# EAGLE schematic al_1S_charger (EAGLE 9.6.2)
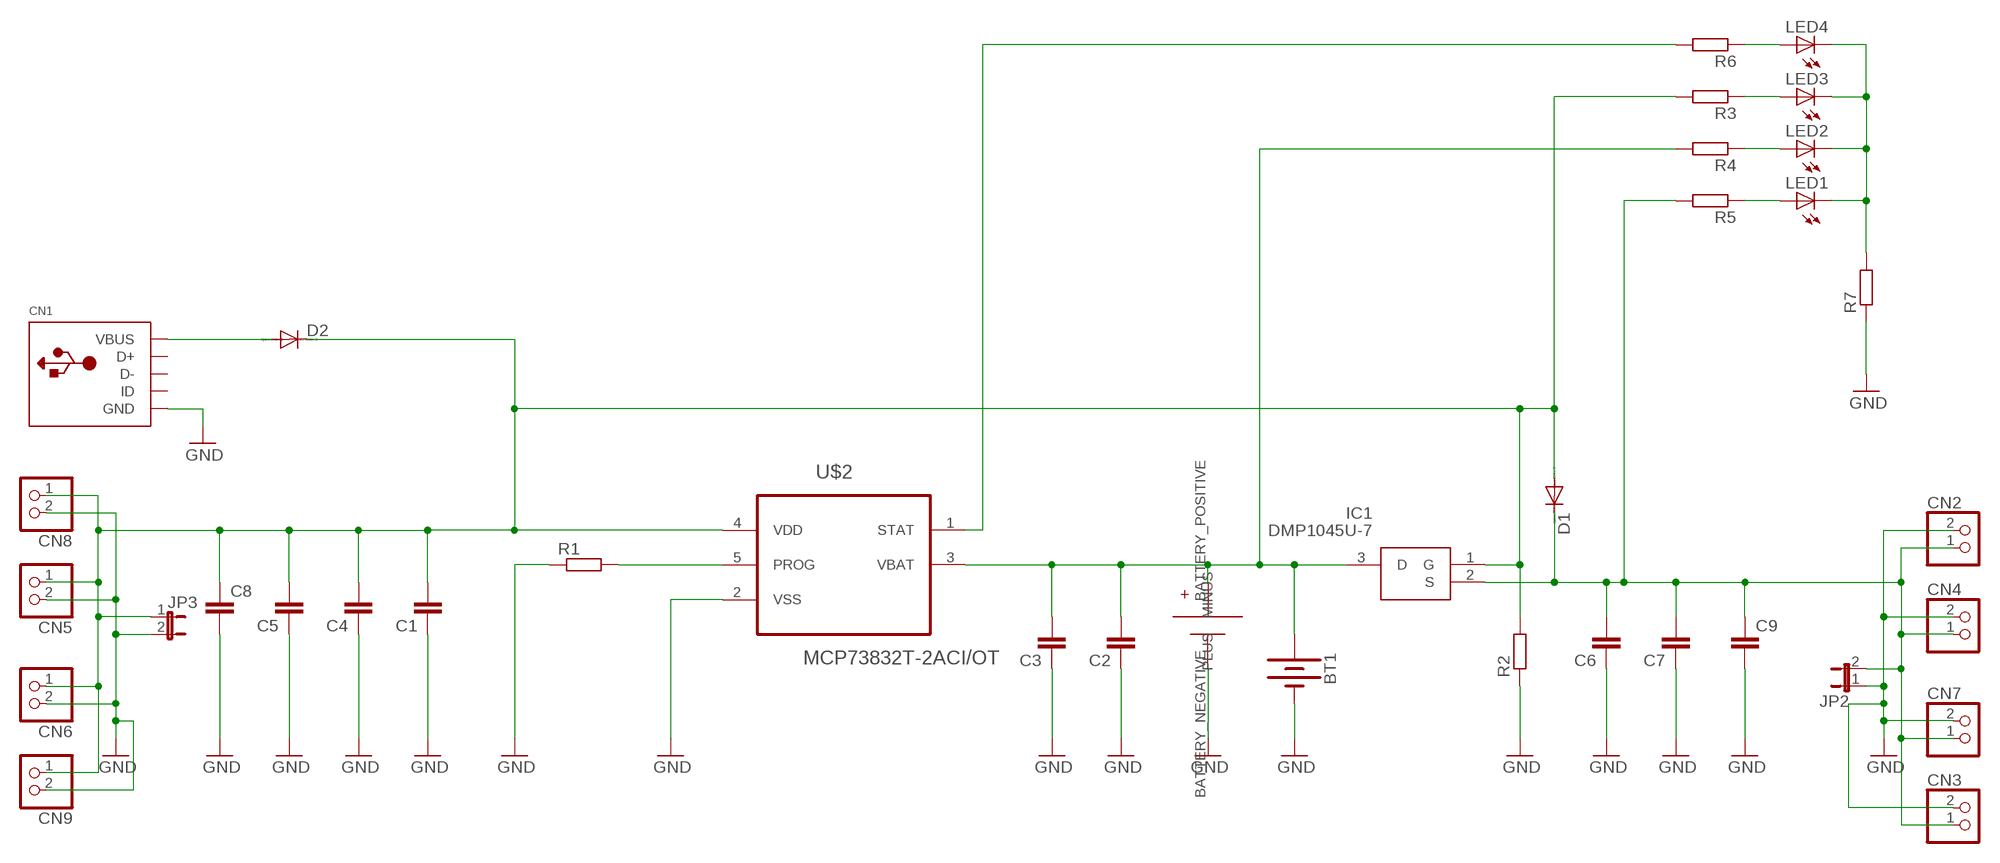
[diagram p0: schematic, sheet 1]

## Parts
BT1  BATTERY-18650  [BATTERY_18650-HOLDER]
C1  C-EUC0603  [C0603]
C2  C-EUC0603  [C0603]
C3  C-EUC0603  [C0603]
C4  C-EUC0603  [C0603]
C5  C-EUC0603  [C0603]
C6  C-EUC0603  [C0603]
C7  C-EUC0603  [C0603]
C8  C-EUC1210  [C1210]
C9  C-EUC1210  [C1210]
CN1  USBMINIB  [USB-MINIB]
CN2  JST_2PIN-SMT-RA  [JST-PH-2-SMT-RA]
CN3  JST_2PIN-SMT-RA  [JST-PH-2-SMT-RA]
CN4  JST_2PIN-THM-RA  [JST-PH-2-THM-RA]
CN5  JST_2PIN-THM-RA  [JST-PH-2-THM-RA]
CN6  JST_2PIN-THM-RA  [JST-PH-2-THM-RA]
CN7  JST_2PIN-THM-RA  [JST-PH-2-THM-RA]
CN8  JST_2PIN-SMT-RA  [JST-PH-2-SMT-RA]
CN9  JST_2PIN-SMT-RA  [JST-PH-2-SMT-RA]
D1  DIODE-SMB  [SMB]
D2  DIODE-SMB  [SMB]
IC1  DMP1045U-7  [SOT96P240X100-3N]
JP2  JP1E  [JP1]
JP3  JP1E  [JP1]
LED1  LEDCHIP-LED0603  [CHIP-LED0603]
LED2  LEDCHIP-LED0603  [CHIP-LED0603]
LED3  LEDCHIP-LED0603  [CHIP-LED0603]
LED4  LEDCHIP-LED0603  [CHIP-LED0603]
R1  R-EU_R0603  [R0603]
R2  R-EU_R0603  [R0603]
R3  R-EU_R0603  [R0603]
R4  R-EU_R0603  [R0603]
R5  R-EU_R0603  [R0603]
R6  R-EU_R0603  [R0603]
R7  R-EU_R0603  [R0603]
U$1  SMT18650_SMT18650  [SMT18650_18650SMT]
U$2  MCP73832T-2ACI/OT  [SOT95P280X145-5N]

## Nets
GND: BT1.GND@1(-) C1.1 C2.1 C3.1 C4.1 C5.1 C6.1 C7.1 C8.2 C9.2 CN1.GND CN2.2 CN3.2 CN4.2 CN5.2 CN6.2 CN7.2 CN8.2 CN9.2 JP2.1 JP3.2 R1.1 R2.1 R7.1 U$1.BATTERY_NEGATIVE(MINUS) U$2.2(VSS)
N$1: BT1.PWR@1(+) C2.2 C3.2 IC1.3(D) R4.2 U$1.BATTERY_POSITIVE(PLUS) U$2.3(VBAT)
N$2: LED4.A R6.1
N$3: C1.2 C4.2 C5.2 C8.1 CN5.1 CN6.1 CN8.1 CN9.1 D1.A D2.C IC1.1(G) JP3.1 R2.2 R3.2 U$2.4(VDD)
N$4: CN1.VBUS D2.A
N$5: R1.2 U$2.5(PROG)
N$6: LED3.A R3.1
N$7: LED2.A R4.1
N$8: LED1.A R5.1
N$9: C6.2 C7.2 C9.1 CN2.1 CN3.1 CN4.1 CN7.1 D1.C IC1.2(S) JP2.2 R5.2
N$10: R6.2 U$2.1(STAT)
N$12: LED1.C LED2.C LED3.C LED4.C R7.2
Unconnected: CN1.D+ CN1.D- CN1.ID

## Library data of the parts
BT1 = SparkFun-Batteries:BATTERY: Battery - Single Cell A variety of battery chemistries, sizes, and footprints. Device List: 20MM_PTH - Coin Cell Battery Holder - 20mm (PTH) <https://www.sparkfun.com/products/783> 6.8MM_PTH - Coin Cell Battery Holder - 6.8MM(SMD) <https://www.digikey.com/product-detail/en/seiko-instruments/MS621FE-FL11E/728-1057-ND/1889208?WT.srch=1&gclid=CNOQ5a6LzdQCFZS2wAodXCkE0g> 12MM_SMD - Coin Cell Battery Holder - 12mm (SMD) <https://www.sparkfun.com/products/10592> 12MM_PTH - Coin Cell Battery Holder - 12mm (PTH) <https://www.sparkfun.com/products/7948> 20MM_SMD - 20mm Coin Cell Battery Holder (SMD) (2 legs) Used on the Big Time Watch Kit <https://www.sparkfun.com/products/11734> 20MM_SMD_4LEGS - Coin Cell Battery Holder - 20mm (SMD) <https://www.sparkfun.com/products/11892> 20MM_SMD_4LEGS_OVERPASTE - Coin Cell Battery Holder - 20mm (SMD) <https://www.sparkfun.com/products/11892> (Over-paste on the legs) 24.5MM_PTH - Coin Cell Battery Holder - 24.5mm (PTH) <https://www.sparkfun.com/products/8863> 9V - 9V Battery Holder - PC Mount Used on the SparkFun SparkPunk Sound Kit <https://www.sparkfun.com/products/11177> and SparkFun SparkPunk Sequencer Kit <https://www.sparkfun.com/products/12707> 18650 - Battery Holder - 18650 (PTH) <https://www.sparkfun.com/products/13113> AA - Battery Holder - 1xAA (PTH) <https://www.sparkfun.com/products/7949> AAA - Battery Holder - 1xAAA (PTH) <https://www.sparkfun.com/products/12718> AA_KIT - Battery Holder - 1xAA (PTH) <https://www.sparkfun.com/products/7949> Special kit package - pads only have exposed copper on one side of the board. AAA_KIT - Battery Holder - 1xAAA (PTH) <https://www.sparkfun.com/products/12718> Special kit package - pads only have exposed copper on one side of the board.; PROD_ID: BATT-12327; SF_SKU: PRT-13113
C1-C7 = resistor:C-EU: CAPACITOR, European symbol
C8 C9 = rcl:C-EU: CAPACITOR, European symbol; SPICEPREFIX: C
CN1 = adafruit:USB: USB Connectors USBMINIB - Surface Mount Female Mini-B USB Connector 4UConnector: 06564 By microbuilder.eu Thru-hole RA Female Mini-B USB Connector 4UConnector: 18732 By ladyada.net
CN2-CN9 = adafruit:JST_2PIN: JST 2-Pin Connectors of various flavors SMT-RA (S2B-PH-SM4) 4UConnector #17311 SMT (B2B-PH-SM4) THM-RA (S2B-PH) THM (B2B-PH)
D1 D2 = diode:DIODE-: DIODE
IC1 = DMP1045U-7:DMP1045U-7: P-Channel Enhancement MOSFET SOT-23 Diodes Inc DMP1045U-7 P-channel MOSFET Transistor, 5.2 A, -12 V, 3-Pin SOT23 Source: Datasheet <http://docs-europe.electrocomponents.com/webdocs/1325/0900766b813253b4.pdf>; ALLIED_NUMBER: 70551254; ALLIED_PRICE/STOCK: http://www.alliedelec.com/diodes-inc-dmp1045u-7/70551254/; ARROW_PART_NUMBER: DMP1045U-7; ARROW_PRICE/STOCK: https://www.arrow.com/en/products/dmp1045u-7/diodes-incorporated; DESCRIPTION: P-Channel Enhancement MOSFET SOT-23 Diodes Inc DMP1045U-7 P-channel MOSFET Transistor, 5.2 A, -12 V, 3-Pin SOT23; HEIGHT: 1mm; MANUFACTURER_NAME: Diodes Inc.; MANUFACTURER_PART_NUMBER: DMP1045U-7; RS_PART_NUMBER: 8222605P; RS_PRICE/STOCK: http://uk.rs-online.com/web/p/products/8222605P
JP2 JP3 = jumper:JP1E: JUMPER
LED1-LED4 = adafruit:LED: LED OSRAM: - CHIPLED LG R971, LG N971, LY N971, LG Q971, LY Q971, LO R971, LY R971 LH N974, LH R974 LS Q976, LO Q976, LY Q976 LO Q996 - Hyper CHIPLED LW Q18S LB Q993, LB Q99A, LB R99A - SideLED LS A670, LO A670, LY A670, LG A670, LP A670 LB A673, LV A673, LT A673, LW A673 LH A674 LY A675 LS A676, LA A676, LO A676, LY A676, LW A676 LS A679, LY A679, LG A679 - Hyper Micro SIDELED® LS Y876, LA Y876, LO Y876, LY Y876 LT Y87S - SmartLED LW L88C, LW L88S LB L89C, LB L89S, LG L890 LS L89K, LO L89K, LY L89K LS L896, LA L896, LO L896, LY L896 - TOPLED LS T670, LO T670, LY T670, LG T670, LP T670 LSG T670, LSP T670, LSY T670, LOP T670, LYG T670 LG T671, LOG T671, LSG T671 LB T673, LV T673, LT T673, LW T673 LH T674 LS T676, LA T676, LO T676, LY T676, LB T676, LH T676, LSB T676, LW T676 LB T67C, LV T67C, LT T67C, LS T67K, LO T67K, LY T67K, LW E67C LS E67B, LA E67B, LO E67B, LY E67B, LB E67C, LV E67C, LT E67C LW T67C LS T679, LY T679, LG T679 LS T770, LO T770, LY T770, LG T770, LP T770 LB T773, LV T773, LT T773, LW T773 LH T774 LS E675, LA E675, LY E675, LS T675 LS T776, LA T776, LO T776, LY T776, LB T776 LHGB T686 LT T68C, LB T68C - Hyper Mini TOPLED® LB M676 - Mini TOPLED Santana® LG M470 LS M47K, LO M47K, LY M47K Source: http://www.osram.convergy.de/
R1-R7 = rcl:R-EU_: RESISTOR, European symbol; SPICEPREFIX: R
U$1 = al_dbl_battery:SMT18650_SMT18650
U$2 = Microchip_By_element14_Batch_1:MCP73832T-2ACI/OT: Charge Management Controller; MPN: MCP73832T-2ACI/OT; OC_FARNELL: 1332159; OC_NEWARK: 88K5656; PACKAGE: SOT-5; SUPPLIER: Microchip